# EAGLE schematic BT_RN42_schematic (EAGLE 7.2.0)
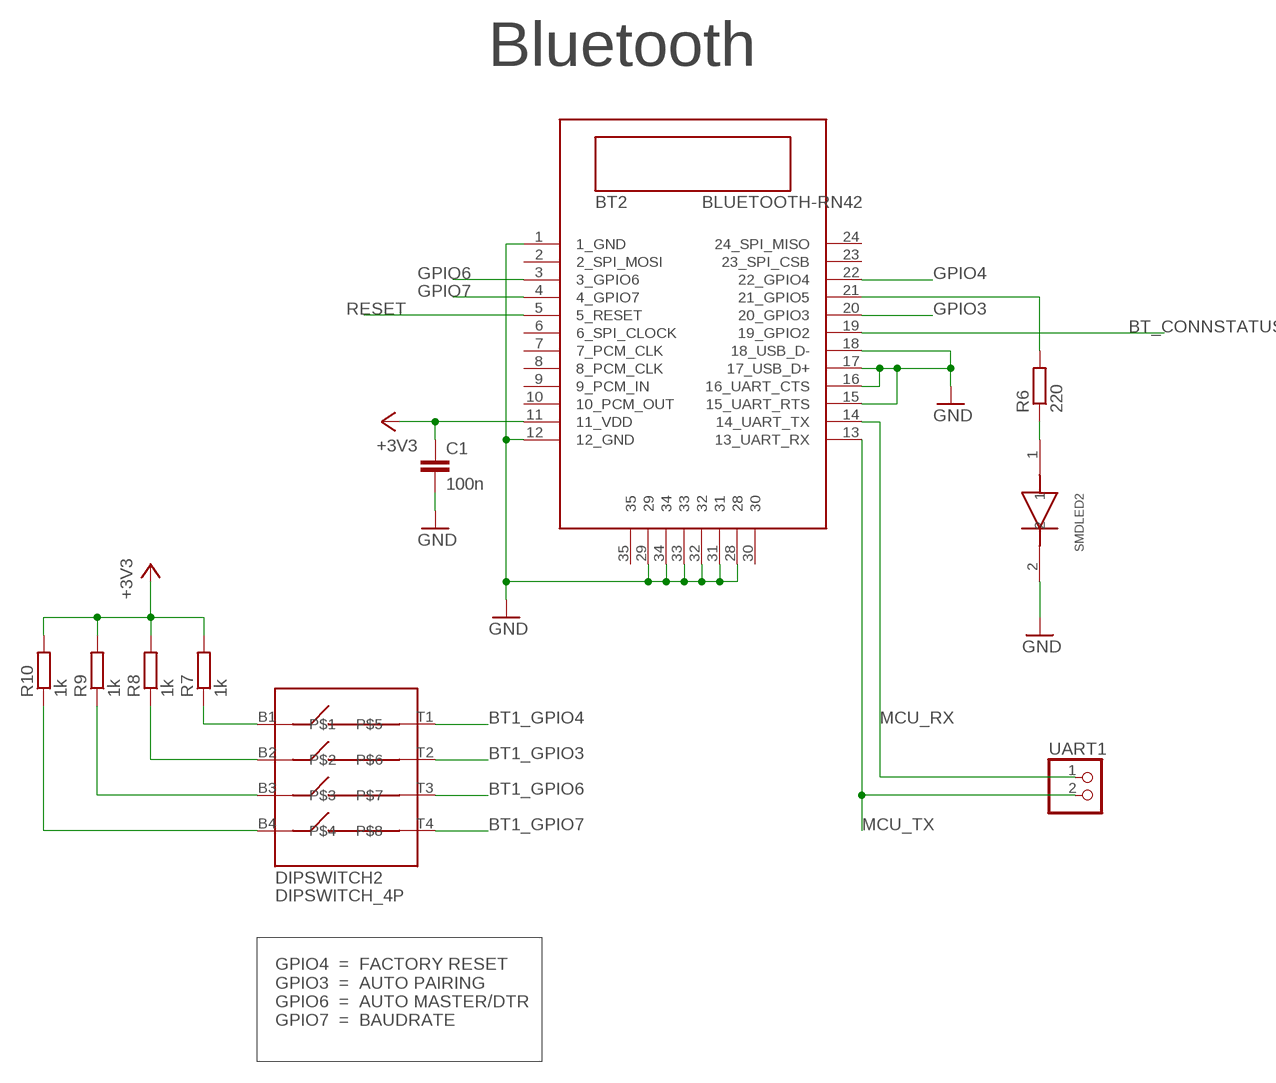
[diagram p0: schematic, sheet 1]

## Parts
BT2  BLUETOOTH-RN42  [RN42]
C1  100n  C-EUC0805  [C0805]
DIPSWITCH2  DIPSWITCH_4P  [DIPSWITCH4P]
R6  220  R-EU_R0805  [R0805]
R7  1k  R-EU_R0805  [R0805]
R8  1k  R-EU_R0805  [R0805]
R9  1k  R-EU_R0805  [R0805]
R10  1k  R-EU_R0805  [R0805]
SMDLED2  SMD_LED  [SMD_LED_CUSTOM]
UART1  PINHD-1X2  [1X02]

## Nets
+3V3: BT2.11(11_VDD) C1.1 R7.2 R8.2 R9.2 R10.2
BT1_GPIO3: DIPSWITCH2.T2
BT1_GPIO4: DIPSWITCH2.T1
BT1_GPIO6: DIPSWITCH2.T3
BT1_GPIO7: DIPSWITCH2.T4
BT_CONNSTATUS: BT2.19(19_GPIO2)
GND: BT2.1(1_GND) BT2.12(12_GND) BT2.15(15_UART_RTS) BT2.16(16_UART_CTS) BT2.17(17_USB_D+) BT2.18(18_USB_D-) BT2.28 BT2.29 BT2.31 BT2.32 BT2.33 BT2.34 C1.2 SMDLED2.2
GPIO3: BT2.20(20_GPIO3)
GPIO4: BT2.22(22_GPIO4)
GPIO6: BT2.3(3_GPIO6)
GPIO7: BT2.4(4_GPIO7)
MCU_RX: BT2.14(14_UART_TX) UART1.1
MCU_TX: BT2.13(13_UART_RX) UART1.2
N$6: BT2.21(21_GPIO5) R6.2
N$7: DIPSWITCH2.B1 R7.1
N$8: DIPSWITCH2.B2 R8.1
N$9: DIPSWITCH2.B3 R9.1
N$10: DIPSWITCH2.B4 R10.1
N$11: R6.1 SMDLED2.1
RESET: BT2.5(5_RESET)
Unconnected: BT2.2(2_SPI_MOSI) BT2.6(6_SPI_CLOCK) BT2.7(7_PCM_CLK) BT2.8(8_PCM_CLK) BT2.9(9_PCM_IN) BT2.10(10_PCM_OUT) BT2.23(23_SPI_CSB) BT2.24(24_SPI_MISO) BT2.30 BT2.35

## Notes on the sheet
- Bluetooth
- GPIO4  =  FACTORY RESET
  GPIO3  =  AUTO PAIRING
  GPIO6  =  AUTO MASTER/DTR
  GPIO7  =  BAUDRATE

## Library data of the parts
BT2 = RN42:BLUETOOTH-RN42
C1 = rcl:C-EU: CAPACITOR, European symbol
DIPSWITCH2 = dipswitch4p_updated:DIPSWITCH_4P
R6-R10 = resistor:R-EU_: RESISTOR, European symbol
SMDLED2 = greenled_smd:SMD_LED
UART1 = pinhead:PINHD-1X2: PIN HEADER